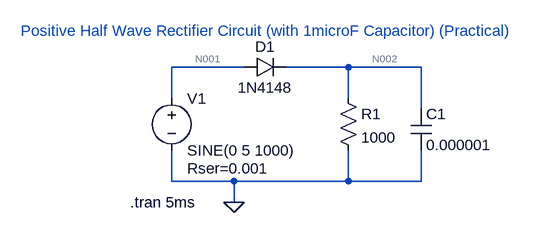
[diagram p0: schematic Assignment 3a (iv).asc]
Assignment 3a (iv).asc, the LTspice schematic file:
Version 4.1
SHEET 1 880 680
WIRE 320 64 208 64
WIRE 480 64 384 64
WIRE 592 64 480 64
WIRE 208 112 208 64
WIRE 480 112 480 64
WIRE 592 128 592 64
WIRE 208 240 208 192
WIRE 304 240 208 240
WIRE 480 240 480 192
WIRE 480 240 304 240
WIRE 592 240 592 192
WIRE 592 240 480 240
WIRE 304 272 304 240
FLAG 304 272 0
SYMBOL voltage 208 96 R0
WINDOW 123 0 0 Left 2
WINDOW 39 24 124 Left 2
SYMATTR SpiceLine Rser=0.001
SYMATTR InstName V1
SYMATTR Value SINE(0 5 1000)
SYMBOL res 464 96 R0
SYMATTR InstName R1
SYMATTR Value 1000
SYMBOL diode 320 80 R270
WINDOW 0 32 32 VTop 2
WINDOW 3 0 32 VBottom 2
SYMATTR InstName D1
SYMATTR Value 1N4148
SYMBOL cap 576 128 R0
SYMATTR InstName C1
SYMATTR Value 0.000001
TEXT 144 272 Left 2 !.tran 5ms
TEXT -24 8 Left 2 ;Positive Half Wave Rectifier Circuit (with 1microF Capacitor) (Practical)

The netlist it stands for:
* Assignment 3a (iv).asc
V1 N001 0 SINE(0 5 1000) Rser=0.001
R1 N002 0 1000
D1 N001 N002 1N4148
C1 N002 0 0.000001
.model D D
.lib standard.dio
.tran 5ms
* Positive Half Wave Rectifier Circuit (with 1microF Capacitor) (Practical)
.backanno
.end

* Results of the author's LTspice run, read from the files saved beside the schematic
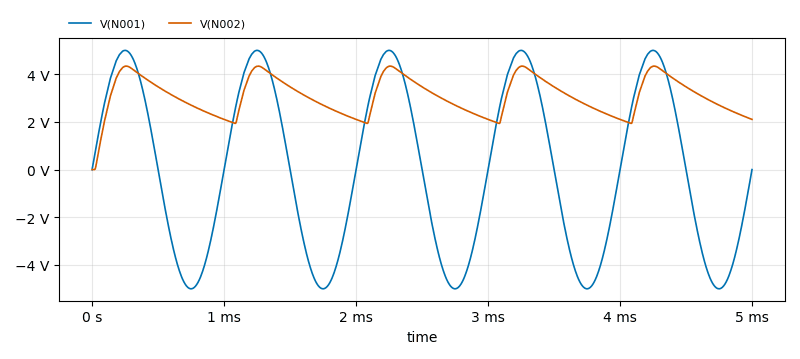
[diagram p1: Transient Analysis of Assignment 3a (iv).asc, plotted from the saved traces]
* Transient Analysis, 1 run:
*   V(N001): min -5 V, max 5 V, average -2.363 mV, rms 3.534 V, last 0 V
*   V(N002): min 0 V, max 4.339 V, average 3.061 V, rms 3.165 V, last 2.105 V